# EAGLE schematic schematics (EAGLE 8.3.2)
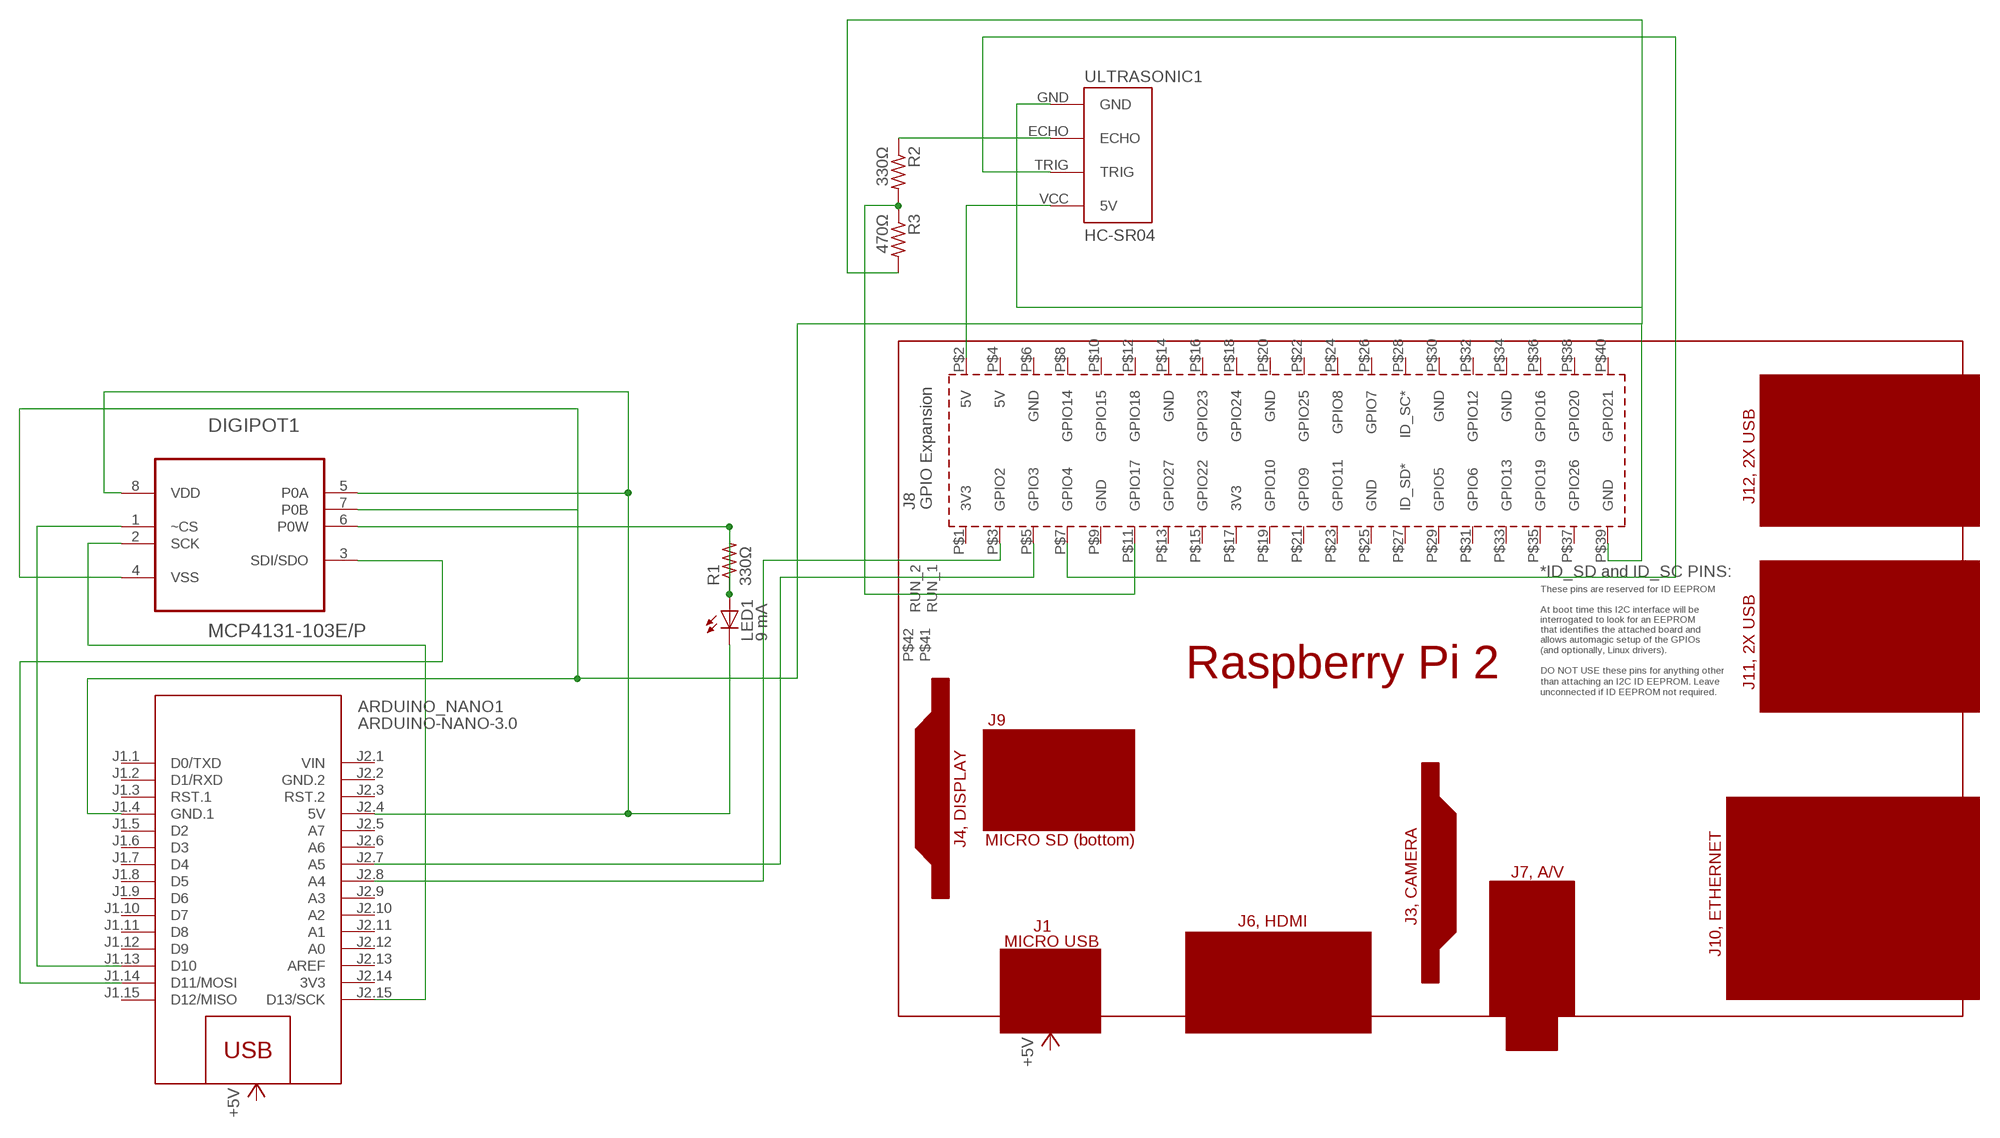
[diagram p0: schematic, sheet 1]

## Parts
ARDUINO_NANO1  ARDUINO-NANO-3.0  [ARDUINO-NANO-3.0]
DIGIPOT1  MCP4131-103E/P  [DIP254P762X533-8]
LED1  9 mA  LED  [SMARTLED-TTW]
R1  330Ω  R-US_0207/10  [0207/10]
R2  330Ω  R-US_0204/7  [0204/7]
R3  470Ω  R-US_0204/7  [0204/7]
RASPBERRY_PI_TWO1  RPI2  [RPI2]
ULTRASONIC1  HC-SR04  [HC-SR04_FOOTPRINT]

## Nets
N$1: ARDUINO_NANO1.J1.4(GND.1) DIGIPOT1.4(VSS) DIGIPOT1.7(P0B) R3.2 RASPBERRY_PI_TWO1.P$39(GND) ULTRASONIC1.GND
N$2: RASPBERRY_PI_TWO1.P$2(5V) ULTRASONIC1.VCC(5V)
N$3: RASPBERRY_PI_TWO1.P$7(GPIO4) ULTRASONIC1.TRIG
N$4: ARDUINO_NANO1.J2.4(5V) DIGIPOT1.5(P0A) DIGIPOT1.8(VDD) LED1.C@1(C)
N$5: ARDUINO_NANO1.J1.13(D10) DIGIPOT1.1(~CS)
N$6: ARDUINO_NANO1.J2.15(D13/SCK) DIGIPOT1.2(SCK)
N$7: ARDUINO_NANO1.J2.8(A4) RASPBERRY_PI_TWO1.P$3(GPIO2)
N$8: ARDUINO_NANO1.J2.7(A5) RASPBERRY_PI_TWO1.P$5(GPIO3)
N$9: ARDUINO_NANO1.J1.14(D11/MOSI) DIGIPOT1.3(SDI/SDO)
N$10: R2.1 ULTRASONIC1.ECHO
N$11: R2.2 R3.1 RASPBERRY_PI_TWO1.P$11(GPIO17)
N$12: DIGIPOT1.6(P0W) LED1.A@1(A) R1.1 R1.2
Unconnected: ARDUINO_NANO1.J1.1(D0/TXD) ARDUINO_NANO1.J1.2(D1/RXD) ARDUINO_NANO1.J1.3(RST.1) ARDUINO_NANO1.J1.5(D2) ARDUINO_NANO1.J1.6(D3) ARDUINO_NANO1.J1.7(D4) ARDUINO_NANO1.J1.8(D5) ARDUINO_NANO1.J1.9(D6) ARDUINO_NANO1.J1.10(D7) ARDUINO_NANO1.J1.11(D8) ARDUINO_NANO1.J1.12(D9) ARDUINO_NANO1.J1.15(D12/MISO) ARDUINO_NANO1.J2.3(RST.2) ARDUINO_NANO1.J2.5(A7) ARDUINO_NANO1.J2.6(A6) ARDUINO_NANO1.J2.9(A3) ARDUINO_NANO1.J2.10(A2) ARDUINO_NANO1.J2.11(A1) ARDUINO_NANO1.J2.12(A0) ARDUINO_NANO1.J2.13(AREF) RASPBERRY_PI_TWO1.P$1(3V3) RASPBERRY_PI_TWO1.P$4(5V) RASPBERRY_PI_TWO1.P$6(GND) RASPBERRY_PI_TWO1.P$8(GPIO14) RASPBERRY_PI_TWO1.P$9(GND) RASPBERRY_PI_TWO1.P$10(GPIO15) RASPBERRY_PI_TWO1.P$12(GPIO18) RASPBERRY_PI_TWO1.P$13(GPIO27) RASPBERRY_PI_TWO1.P$14(GND) RASPBERRY_PI_TWO1.P$15(GPIO22) RASPBERRY_PI_TWO1.P$16(GPIO23) RASPBERRY_PI_TWO1.P$17(3V3) RASPBERRY_PI_TWO1.P$18(GPIO24) RASPBERRY_PI_TWO1.P$19(GPIO10) RASPBERRY_PI_TWO1.P$20(GND) RASPBERRY_PI_TWO1.P$21(GPIO9) RASPBERRY_PI_TWO1.P$22(GPIO25) RASPBERRY_PI_TWO1.P$23(GPIO11) RASPBERRY_PI_TWO1.P$24(GPIO8) RASPBERRY_PI_TWO1.P$25(GND) RASPBERRY_PI_TWO1.P$26(GPIO7) RASPBERRY_PI_TWO1.P$27(ID_SD*) RASPBERRY_PI_TWO1.P$28(ID_SC*) RASPBERRY_PI_TWO1.P$29(GPIO5) RASPBERRY_PI_TWO1.P$30(GND) RASPBERRY_PI_TWO1.P$31(GPIO6) RASPBERRY_PI_TWO1.P$32(GPIO12) RASPBERRY_PI_TWO1.P$33(GPIO13) RASPBERRY_PI_TWO1.P$34(GND) RASPBERRY_PI_TWO1.P$35(GPIO19) RASPBERRY_PI_TWO1.P$36(GPIO16) RASPBERRY_PI_TWO1.P$37(GPIO26) RASPBERRY_PI_TWO1.P$38(GPIO20) RASPBERRY_PI_TWO1.P$40(GPIO21) RASPBERRY_PI_TWO1.P$41(RUN_1) RASPBERRY_PI_TWO1.P$42(RUN_2)

## Power pins joined to a net without a drawn wire
3V3: ARDUINO_NANO1.J2.14(3V3)
GND.2: ARDUINO_NANO1.J2.2(GND.2)
VIN: ARDUINO_NANO1.J2.1(VIN)

## Library data of the parts
ARDUINO_NANO1 = diy-modules:ARDUINO-NANO-3.0: Arduino Nano 3.0
DIGIPOT1 = Microchip_By_element14_Batch_1:MCP4131-103E/P: SPI Digital POT; MPN: MCP4131-103E/P; OC_FARNELL: 1834951; OC_NEWARK: 77M2570; PACKAGE: DIP-8; SUPPLIER: Microchip
LED1 = led:LED: LED OSRAM: - CHIPLED LG R971, LG N971, LY N971, LG Q971, LY Q971, LO R971, LY R971 LH N974, LH R974 LS Q976, LO Q976, LY Q976 LO Q996 - Hyper CHIPLED LW Q18S LB Q993, LB Q99A, LB R99A - SideLED LS A670, LO A670, LY A670, LG A670, LP A670 LB A673, LV A673, LT A673, LW A673 LH A674 LY A675 LS A676, LA A676, LO A676, LY A676, LW A676 LS A679, LY A679, LG A679 - Hyper Micro SIDELED® LS Y876, LA Y876, LO Y876, LY Y876 LT Y87S - SmartLED LW L88C, LW L88S LB L89C, LB L89S, LG L890 LS L89K, LO L89K, LY L89K LS L896, LA L896, LO L896, LY L896 - TOPLED LS T670, LO T670, LY T670, LG T670, LP T670 LSG T670, LSP T670, LSY T670, LOP T670, LYG T670 LG T671, LOG T671, LSG T671 LB T673, LV T673, LT T673, LW T673 LH T674 LS T676, LA T676, LO T676, LY T676, LB T676, LH T676, LSB T676, LW T676 LB T67C, LV T67C, LT T67C, LS T67K, LO T67K, LY T67K, LW E67C LS E67B, LA E67B, LO E67B, LY E67B, LB E67C, LV E67C, LT E67C LW T67C LS T679, LY T679, LG T679 LS T770, LO T770, LY T770, LG T770, LP T770 LB T773, LV T773, LT T773, LW T773 LH T774 LS E675, LA E675, LY E675, LS T675 LS T776, LA T776, LO T776, LY T776, LB T776 LHGB T686 LT T68C, LB T68C - Hyper Mini TOPLED® LB M676 - Mini TOPLED Santana® LG M470 LS M47K, LO M47K, LY M47K Source: http://www.osram.convergy.de LUXEON: - LUMILED® LXK2-PW12-R00, LXK2-PW12-S00, LXK2-PW14-U00, LXK2-PW14-V00 LXK2-PM12-R00, LXK2-PM12-S00, LXK2-PM14-U00 LXK2-PE12-Q00, LXK2-PE12-R00, LXK2-PE12-S00, LXK2-PE14-T00, LXK2-PE14-U00 LXK2-PB12-K00, LXK2-PB12-L00, LXK2-PB12-M00, LXK2-PB14-N00, LXK2-PB14-P00, LXK2-PB14-Q00 LXK2-PR12-L00, LXK2-PR12-M00, LXK2-PR14-Q00, LXK2-PR14-R00 LXK2-PD12-Q00, LXK2-PD12-R00, LXK2-PD12-S00 LXK2-PH12-R00, LXK2-PH12-S00 LXK2-PL12-P00, LXK2-PL12-Q00, LXK2-PL12-R00 Source: www.luxeon.com KINGBRIGHT: KA-3528ASYC Source: www.kingbright.com
R1-R3 = resistor:R-US_: RESISTOR, American symbol
RASPBERRY_PI_TWO1 = e14_Rpi2_RevA:RPI2: Device for Raspberry Pi 2 board created by www.element14.com More information and support community is available at http://www.element14.com/community/community/raspberry-pi/raspberrypi2
ULTRASONIC1 = Ultrasonic Sensor HC-SR04:HC-SR04: Ultrasonic Sensor HC-SR04